# Altium schematic sheet MIS_Locker_old.SchDoc
size A2
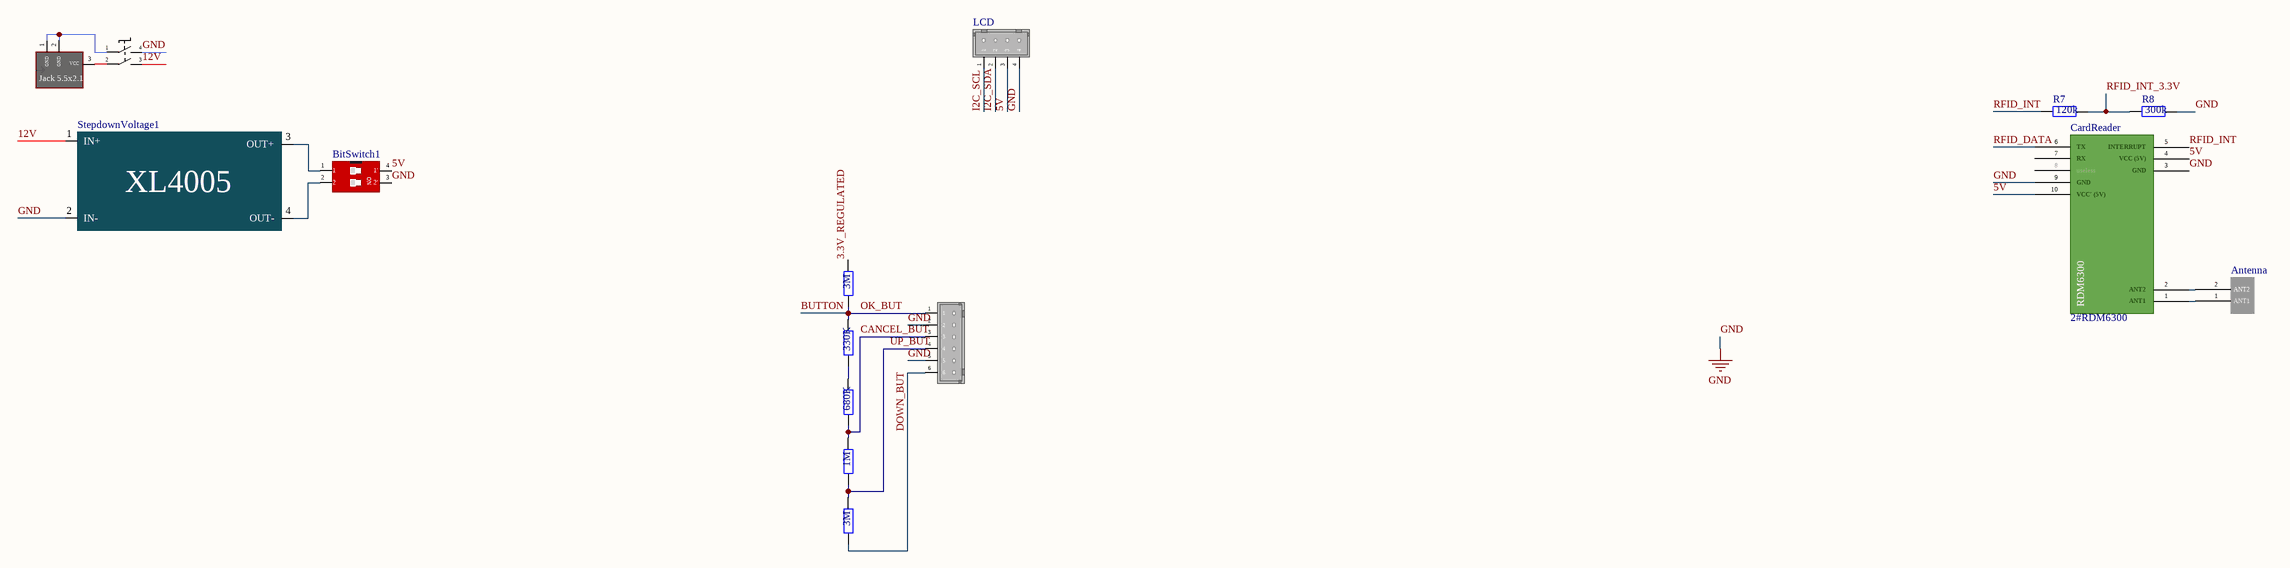
[diagram p0: MIS_Locker_old.SchDoc]

## Parts
Antenna  2#RDM6300_Magnetic_Coil  [2#RDM6300_Magnetic_Coil]  (value not drawn)
BitSwitch1  5#Bit_Switch_2  [5#Bit_Switch_2]  (value not drawn)
Button  5#Jack6_Button  [5#Jack6_Button]  (value not drawn)
CardReader  2#RDM6300  [2#RDM6300]
J1  5#DC Jack 2.54mm  [5#DC Jack 2.54mm]  (value not drawn)
LCD  5#Jack4_LCD  [5#Jack4_LCD]  (value not drawn)
PowerSwitchHole1  5#PowerSwitchHole  [5#PowerSwitchHole]  (value not drawn)
R7  120k  [AXIAL-0.4]
R8  300k  [AXIAL-0.4]
R13  3M  [AXIAL-0.4]
R14  330K  [AXIAL-0.4]
R15  680K  [AXIAL-0.4]
R16  1M  [AXIAL-0.4]
R17  3M  [AXIAL-0.4]
StepdownVoltage1  5#Stepdown_XL4005  [5#Stepdown_XL4005]  (value not drawn)

## Nets
GND: BitSwitch1.3(2') Button.2 Button.5 CardReader.3(GND) CardReader.9(GND) LCD.4 PowerSwitchHole1.4 R8.1 StepdownVoltage1.2(IN-)
3.3V_REGULATED: R13.1
5V: BitSwitch1.4(1') CardReader.4(VCC_(5V)) CardReader.10(VCC'_(5V)) LCD.3
12V: PowerSwitchHole1.3 StepdownVoltage1.1(IN+)
BUTTON: Button.1 R13.2 R14.1  [also labelled OK_BUT]
CANCEL_BUT: Button.3 R15.2 R16.1
DOWN_BUT: Button.6 R17.2
I2C_SCL: LCD.1
I2C_SDA: LCD.2
RFID_DATA: CardReader.6(TX)
RFID_INT: CardReader.5(INTERRUPT) R7.2
RFID_INT_3.3V: R7.1 R8.2
UP_BUT: Button.4 R16.2 R17.1
NetAntenna_1: Antenna.1(ANT1) CardReader.1(ANT1)
NetAntenna_2: Antenna.2(ANT2) CardReader.2(ANT2)
NetBitSwitch1_1: BitSwitch1.1 StepdownVoltage1.3(OUT+)
NetBitSwitch1_2: BitSwitch1.2 StepdownVoltage1.4(OUT-)
NetJ1_1: J1.1(GND) J1.2(GND) PowerSwitchHole1.1
NetJ1_3: J1.3(VCC) PowerSwitchHole1.2
NetR14_2: R14.2 R15.1

Not connected (* = marked no-connect by the designer): CardReader 7(RX) 8(useless)

## Notes on the sheet
- (in symbol 2#RDM6300) RDM6300
- (in symbol 5#Bit_Switch_2) ON
- (in symbol 5#DC Jack 2.54mm) Jack 5.5x2.1
- (in symbol 5#Stepdown_XL4005) XL4005

## Library data of the parts
R7 R8 R13-R17 = Res2: Resistor; Published: 8-Jun-2000; LatestRevisionDate: 17-Jul-2002; LatestRevisionNote: Re-released for DXP Platform.; PackageReference: AXIAL-0.4; Publisher: Altium Limited; PackageDescription: Axial Device, Thru-Hole; 2 Leads; 0.4 in Pin Spacing